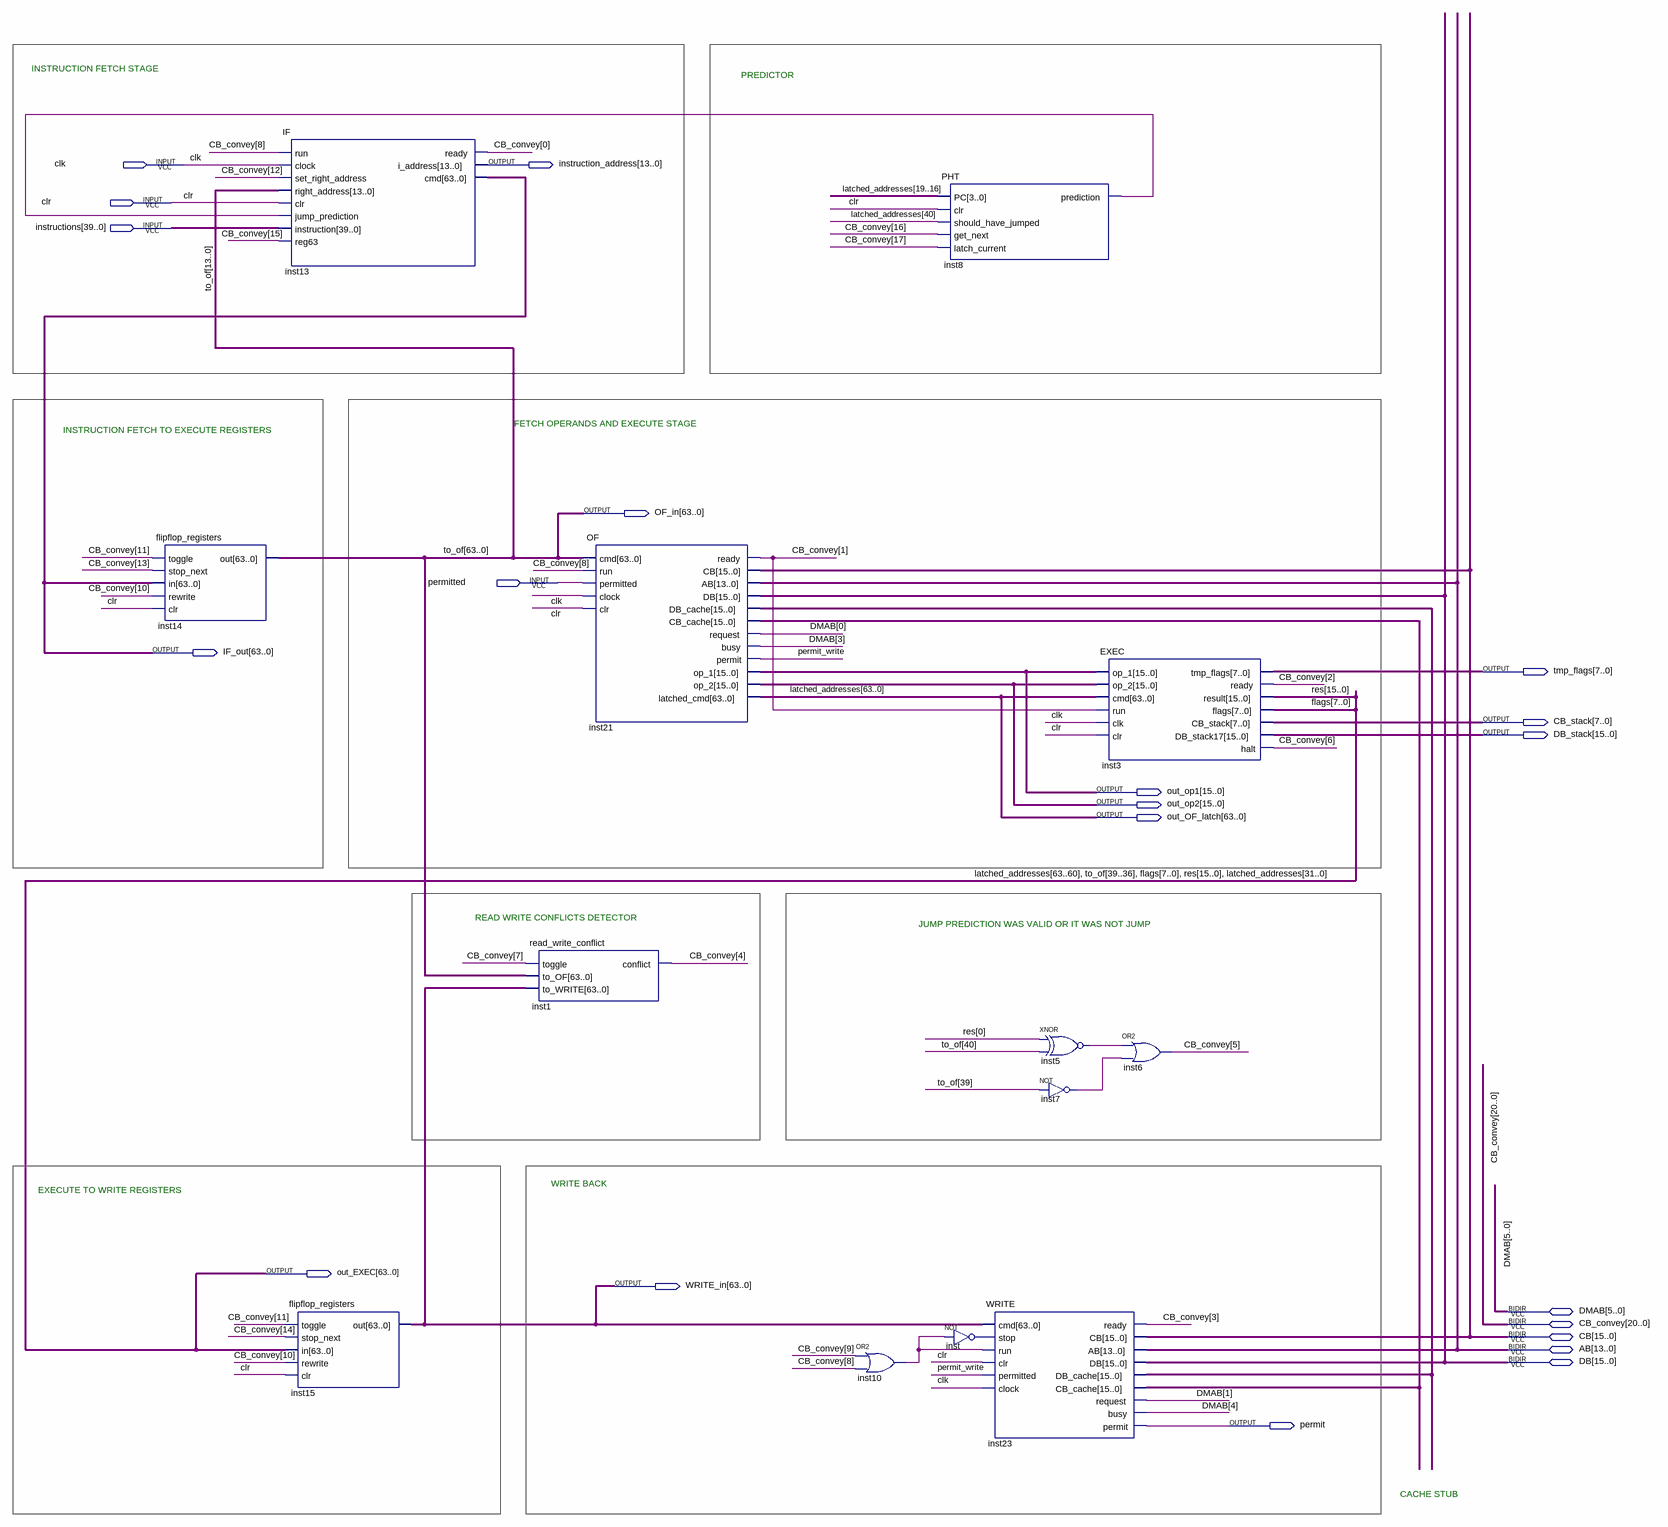
[diagram p0: schematic sheet]
// Quartus schematic convey.bdf as structural Verilog: 13 symbols, 21 pins
module convey (
  input  clk,
  input  clr,
  input  [39:0] instructions,
  input  permitted,
  inout  [5:0] DMAB,
  inout  [20:0] CB_convey,
  inout  [15:0] CB,
  inout  [13:0] AB,
  inout  [15:0] DB,
  output [13:0] instruction_address,
  output [63:0] OF_in,
  output [63:0] IF_out,
  output [7:0] tmp_flags,
  output [7:0] CB_stack,
  output [15:0] DB_stack,
  output [15:0] out_op1,
  output [15:0] out_op2,
  output [63:0] out_OF_latch,
  output [63:0] out_EXEC,
  output [63:0] WRITE_in,
  output permit
);

  wire inst5_out, inst7_out, inst8_prediction, inst10_out, inst_out, permit_write;
  wire [15:0] inst21_cb_cache, inst21_db_cache;

  flipflop_registers inst14 (
    .toggle(CB_convey[11]), .stop_next(CB_convey[13]), .in(IF_out), .rewrite(CB_convey[10]), .clr(clr),
    .out(OF_in));
  IF inst13 (
    .run(CB_convey[8]), .clock(clk), .set_right_address(CB_convey[12]), .right_address(OF_in[13:0]),
    .clr(clr), .jump_prediction(inst8_prediction), .instruction(instructions), .reg63(CB_convey[15]),
    .ready(CB_convey[0]), .i_address(instruction_address), .cmd(IF_out));
  flipflop_registers inst15 (
    .toggle(CB_convey[11]), .stop_next(CB_convey[14]), .in({out_EXEC[63:60], OF_in[39:36], out_EXEC[55:0]}),
    .rewrite(CB_convey[10]), .clr(clr), .out(WRITE_in));
  read_write_conflict inst1 (.toggle(CB_convey[7]), .to_OF(OF_in), .to_WRITE(WRITE_in), .conflict(CB_convey[4]));
  OF inst21 (
    .cmd(OF_in), .run(CB_convey[8]), .permitted(permitted), .clock(clk), .clr(clr), .ready(CB_convey[1]),
    .request(DMAB[0]), .busy(DMAB[3]), .permit(permit_write), .op_1(out_op1), .op_2(out_op2),
    .latched_cmd({out_EXEC[63:60], out_OF_latch[59:32], out_EXEC[31:0]}), .CB(CB), .AB(AB), .DB(DB),
    .DB_cache(inst21_db_cache), .CB_cache(inst21_cb_cache));
  or inst10 (inst10_out, CB_convey[9], CB_convey[8]);
  PHT inst8 (
    .PC(out_EXEC[19:16]), .clr(clr), .should_have_jumped(out_OF_latch[40]), .get_next(CB_convey[16]),
    .latch_current(CB_convey[17]), .prediction(inst8_prediction));
  not inst (inst_out, inst10_out);
  WRITE inst23 (
    .cmd(WRITE_in), .stop(inst_out), .run(inst10_out), .clr(clr), .permitted(permit_write), .clock(clk),
    .ready(CB_convey[3]), .request(DMAB[1]), .busy(DMAB[4]), .permit(permit), .CB(CB), .AB(AB), .DB(DB),
    .DB_cache(inst21_db_cache), .CB_cache(inst21_cb_cache));
  xnor inst5 (inst5_out, out_EXEC[32], OF_in[40]);
  not inst7 (inst7_out, OF_in[39]);
  EXEC inst3 (
    .op_1(out_op1), .op_2(out_op2), .cmd({out_EXEC[63:60], out_OF_latch[59:32], out_EXEC[31:0]}),
    .run(CB_convey[1]), .clk(clk), .clr(clr), .tmp_flags(tmp_flags), .ready(CB_convey[2]),
    .result(out_EXEC[47:32]), .flags(out_EXEC[55:48]), .CB_stack(CB_stack), .DB_stack17(DB_stack),
    .halt(CB_convey[6]));
  or inst6 (CB_convey[5], inst5_out, inst7_out);

  assign out_EXEC[59:56] = OF_in[39:36];
  assign {out_OF_latch[63:60], out_OF_latch[31:0]} = {out_EXEC[63:60], out_EXEC[31:0]};

  // Other names for the same wires on the sheet: res[15:0] = out_EXEC[47:32]; flags[7:0] = out_EXEC[55:48];
  //   to_of[63:0] = OF_in; latched_addresses[63:0] = {out_EXEC[63:60], out_OF_latch[59:32], out_EXEC[31:0]}

  // Notes on the sheet:
  //   INSTRUCTION FETCH STAGE
  //   PREDICTOR
  //   FETCH OPERANDS AND EXECUTE STAGE
  //   INSTRUCTION FETCH TO EXECUTE REGISTERS
  //   READ WRITE CONFLICTS DETECTOR
  //   JUMP PREDICTION WAS VALID OR IT WAS NOT JUMP
  //   WRITE BACK
  //   EXECUTE TO WRITE REGISTERS
  //   CACHE STUB
endmodule
